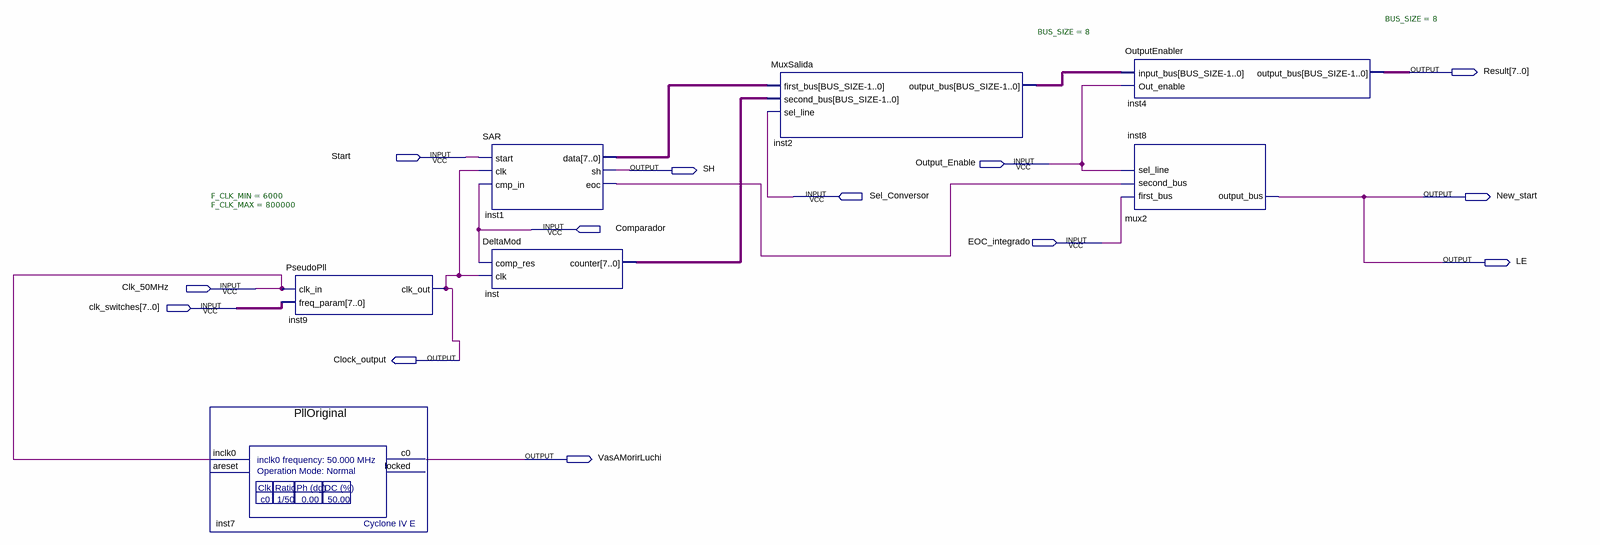
[diagram p0: schematic sheet]
// Quartus schematic main.bdf as structural Verilog: 7 symbols, 13 pins
module main (
  input  Start,
  input  Output_Enable,
  input  Sel_Conversor,
  input  Comparador,
  input  EOC_integrado,
  input  Clk_50MHz,
  input  [7:0] clk_switches,
  output [7:0] Result,
  output SH,
  output New_start,
  output LE,
  output Clock_output,
  output VasAMorirLuchi
);

  wire inst1_eoc;
  wire [7:0] inst1_data, inst2_output_bus, inst_counter;

  PllOriginal inst7 (.inclk0(Clk_50MHz), .c0(VasAMorirLuchi));  // open: areset, locked
  PseudoPll #(.F_CLK_MIN(6000), .F_CLK_MAX(800000)) inst9 (
    .clk_in(Clk_50MHz), .freq_param(clk_switches), .clk_out(Clock_output));
  SAR inst1 (.start(Start), .clk(Clock_output), .cmp_in(Comparador), .data(inst1_data), .sh(SH), .eoc(inst1_eoc));
  DeltaMod inst (.comp_res(Comparador), .clk(Clock_output), .counter(inst_counter));
  MuxSalida #(.BUS_SIZE(8)) inst2 (
    .first_bus(inst1_data), .second_bus(inst_counter), .sel_line(Sel_Conversor), .output_bus(inst2_output_bus));
  OutputEnabler #(.BUS_SIZE(8)) inst4 (.input_bus(inst2_output_bus), .Out_enable(Output_Enable), .output_bus(Result));
  mux2 inst8 (.first_bus(EOC_integrado), .second_bus(inst1_eoc), .sel_line(Output_Enable), .output_bus(LE));

  assign New_start = LE;
endmodule
